# Altium schematic sheet voltage-detection.SchDoc: voltage-detection
size A4; CheckedBy: Nico Bieberich; Author: Leon Loeser; Organization: Baltic Racing; Address1: Zur Schwedenschanze 15; Address2: Haus 18; Address3: 18435 Stralsund; Revision: 1.1; SheetNumber: 2; SheetTotal: 3; Rules: EV4.10.2; ProjectName: Projekt
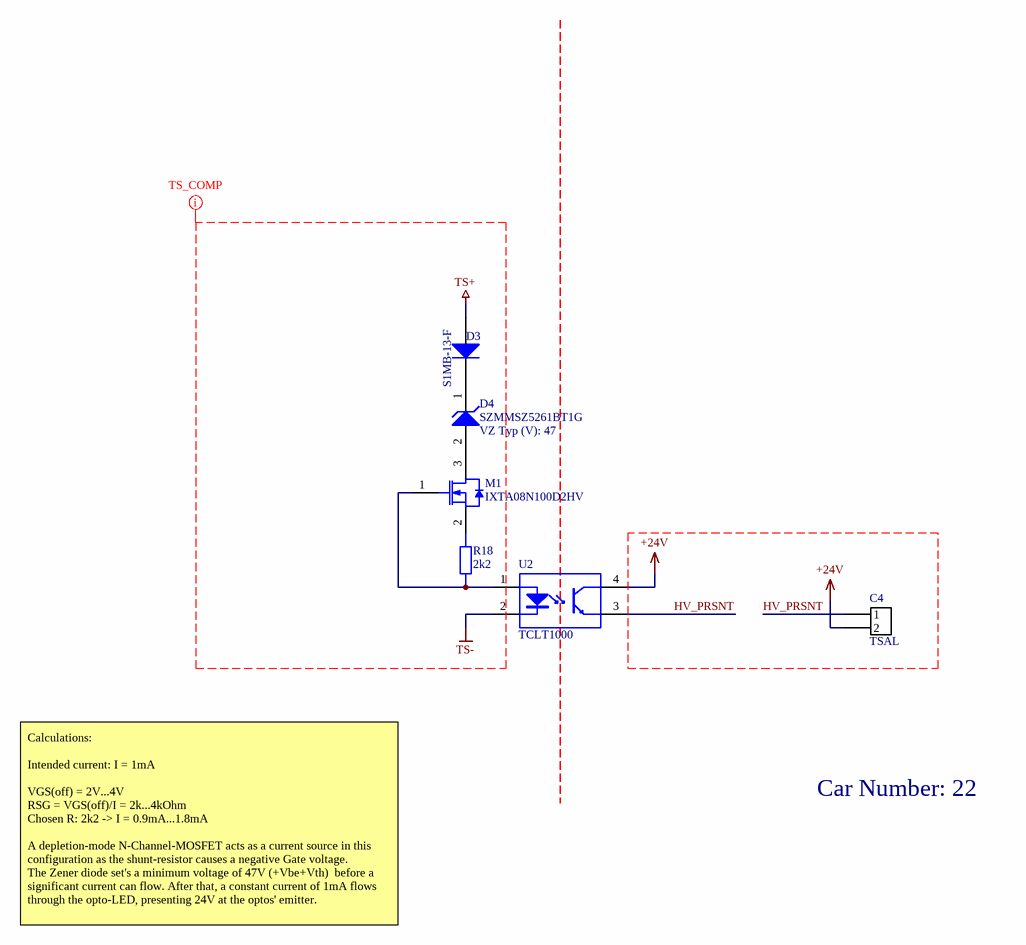
[diagram p0: voltage-detection.SchDoc]

## Parts
C4  TSAL  [43650-0200]
D3  S1MB-13-F  [DIOD-SMB-2_V]
D4  SZMMSZ5261BT1G  VZ Typ (V): 47  [ONSC-SOD-123-2-425-04_V]
M1  IXTA08N100D2HV  [IXYS_TO-263HV]
R18  value 2k2  [STACKPOLE CSR0603]  (hidden comment: SMD Resistor)
U2  TCLT1000  [VISH-SOP4L-4_V]

## Nets
+24V: C4.2 U2.4(C)
TS+: D3.1(A)
TS-: U2.2(C)
HV_PRSNT: C4.1 U2.3(E)
NetD3_2: D3.2(K) D4.1(K)
NetD4_2: D4.2(A) M1.3(DRAIN)
NetM1_1: M1.1(GATE) R18.1 U2.1(A)
NetM1_2: M1.2(SOURCE) R18.2

## Layout directives
net class TS_COMP: TS+, TS-

## Notes on the sheet
- Car Number: 22
- Calculations:
  Intended current: I = 1mA
  VGS(off) = 2V...4V
  RSG = VGS(off)/I = 2k...4kOhm
  Chosen R: 2k2 -> I = 0.9mA...1.8mA
  A depletion-mode N-Channel-MOSFET acts as a current source in this configuration as the shunt-resistor causes a negative Gate voltage.
  The Zener diode set's a minimum voltage of 47V (+Vbe+Vth)  before a significant current can flow. After that, a constant current of 1mA flows through the opto-LED, presenting 24V at the optos' emitter.
- Title:
- Projekt:
- Revision:
- Author:
- Rules:
- Checked by:
- Sheet
- of
- Size:
- A4
- Date:
- Time:

## Library data of the parts
C4 = MicroFit3.0 2-Pin: Molex Micro-Fit 3.0 2-Pin / 600V / 8.5A
D3 = CMP-2000-07013-1: Surface Mount Glass Passivated Rectifier / , 1 A, 1.1 V, -65 to 150 degC, 2-Pin SMD, RoHS, Tape and Reel; Manufacturer: Diodes Inc; Average Rectified Current-Max: 1A; Forward Voltage: 1.1V; Reverse Current-Max: 5µA; Peak Current-Max: 30A; Reverse Voltage-Max [Vrrm]: 1000V; Manufacturer URL: http://www.diodes.com/; Datasheet URL: http://www.diodes.com/_files/datasheets/ds16003.pdf; Datasheet Version: Rev. 24-2, 12/2014; Package Description: 2-Pin Surface Mount Device, Body 4.315 x 3.62 mm; Package Reference: SMB-2; Mounting Technology: SurfaceMount
D4 = CMP-1060-00394-1: Zener Voltage Regulator, 500 mW, 2-Pin SOD-123, Pb-Free, Tape and Reel; Manufacturer: On Semiconductor; P Max (W): 0.5; ComponentLink3Description: Package Specification; PartNumber: SZMMSZ5261BT1G; ComponentLink1Description: Manufacturer URL; ComponentLink2Description: Datasheet; Mounting Technology: Surface Mount; ComponentLink2URL: http://www.onsemi.cn/pub_link/Collateral/MMSZ5221BT1-D.PDF; Packing: Tape and Reel; PackageVersion: Rev. G, 10/2009; RoHS: Pb-Free; ComponentLink1URL: http://www.onsemi.com/; PackageReference: SOD-123-2-425-04; PackageDescription: 2-Pin SOD, Body 1.6 x 2.69 mm; ComponentLink3URL: http://www.onsemi.com/pub_link/Collateral/425-04.PDF; DatasheetVersion: Rev. 12
M1 = IXTA08N100D2HV: D2 Series - 100V - 1700V N-Channel Depletion Mode Power MOSFETs, TO-263HV, RoHS; Manufacturer: Littelfuse; Supplier 1: Arrow Electronics; Manufacturer Part Number: IXTA08N100D2HV; RoHS: Yes; Category: MOSFETs; Stock 1: 30; Pricing 1: 1=1,74230, 300=2,14500, 500=1,90100, 1000=1,67700, 2000=1,66000, 2500=1,64400, 3000=1,62700, 4000=1,61100, 5000=1,59500, 10000=1,57900, 20000=1,56300 (USD); Supplier Part Number 1: IXTA08N100D2HV
R18 = SMD Resistor: Resistor with multiple footprints
U2 = CMP-2000-07234-1: Optocoupler, Phototransistor Output, VCEO 70 V, -55 to 100 degC, 4-Pin SOP (SOP4L), RoHS, Tape and Reel; Manufacturer: Vishay/Semiconductor; Maximum Collector Emitter Voltage: 70V; Input Type: DC; Maximum Reverse Voltage: 6V; Maximum Collector Emitter Saturation Voltage: 300mV; Number of Channels per Chip: 1; Maximum Collector Current: 50mA; Maximum Power Dissipation: 250mW; Maximum Forward Voltage: 1.6V; Maximum Input Current: 60mA; Typical Forward Voltage: 1.25V; Minimum Isolation Voltage: 5000Vrms; Maximum Current Transfer Ratio @ Current: 600%; Manufacturer URL: http://www.vishay.com/; Package: 4SOP; Mounting Technology: SurfaceMount; Category: TransistorandPhotovoltaicOutputPhotoCouplers; Datasheet URL: http://www.vishay.com/docs/83515/tclt1000.pdf; Output Type: DC; Operating Temperature: -40to100°C; Package Description: 4-Pin Small Outline Package Integrated Circuit, Body 4.1 x 7.5 mm, Pitch 2.54 mm; Datasheet Version: Rev. 2.9, 12/2015; Package Reference: SOP4L; Packaging: Tape&Reel